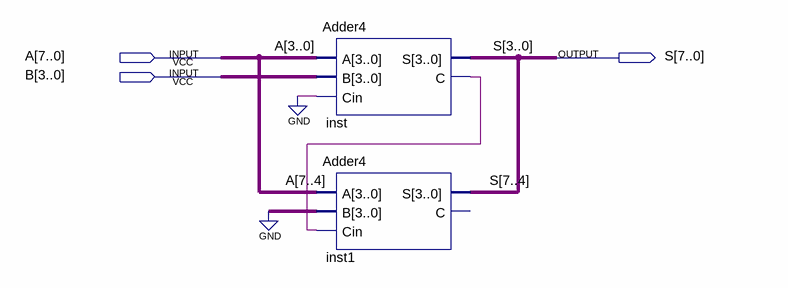
[diagram p0: schematic sheet]
// Quartus schematic Adder8.bdf as structural Verilog: 2 symbols, 3 pins
module Adder8 (
  input  [7:0] A,
  input  [3:0] B,
  output [7:0] S
);

  wire inst_c;

  Adder4 inst (.A(A[3:0]), .B(B), .Cin(1'b0), .S(S[3:0]), .C(inst_c));
  Adder4 inst1 (.A(A[7:4]), .B(4'b0000), .Cin(inst_c), .S(S[7:4]));  // open: C
endmodule
